# Altium schematic sheet CPU_wireless_shield.SchDoc
size A3
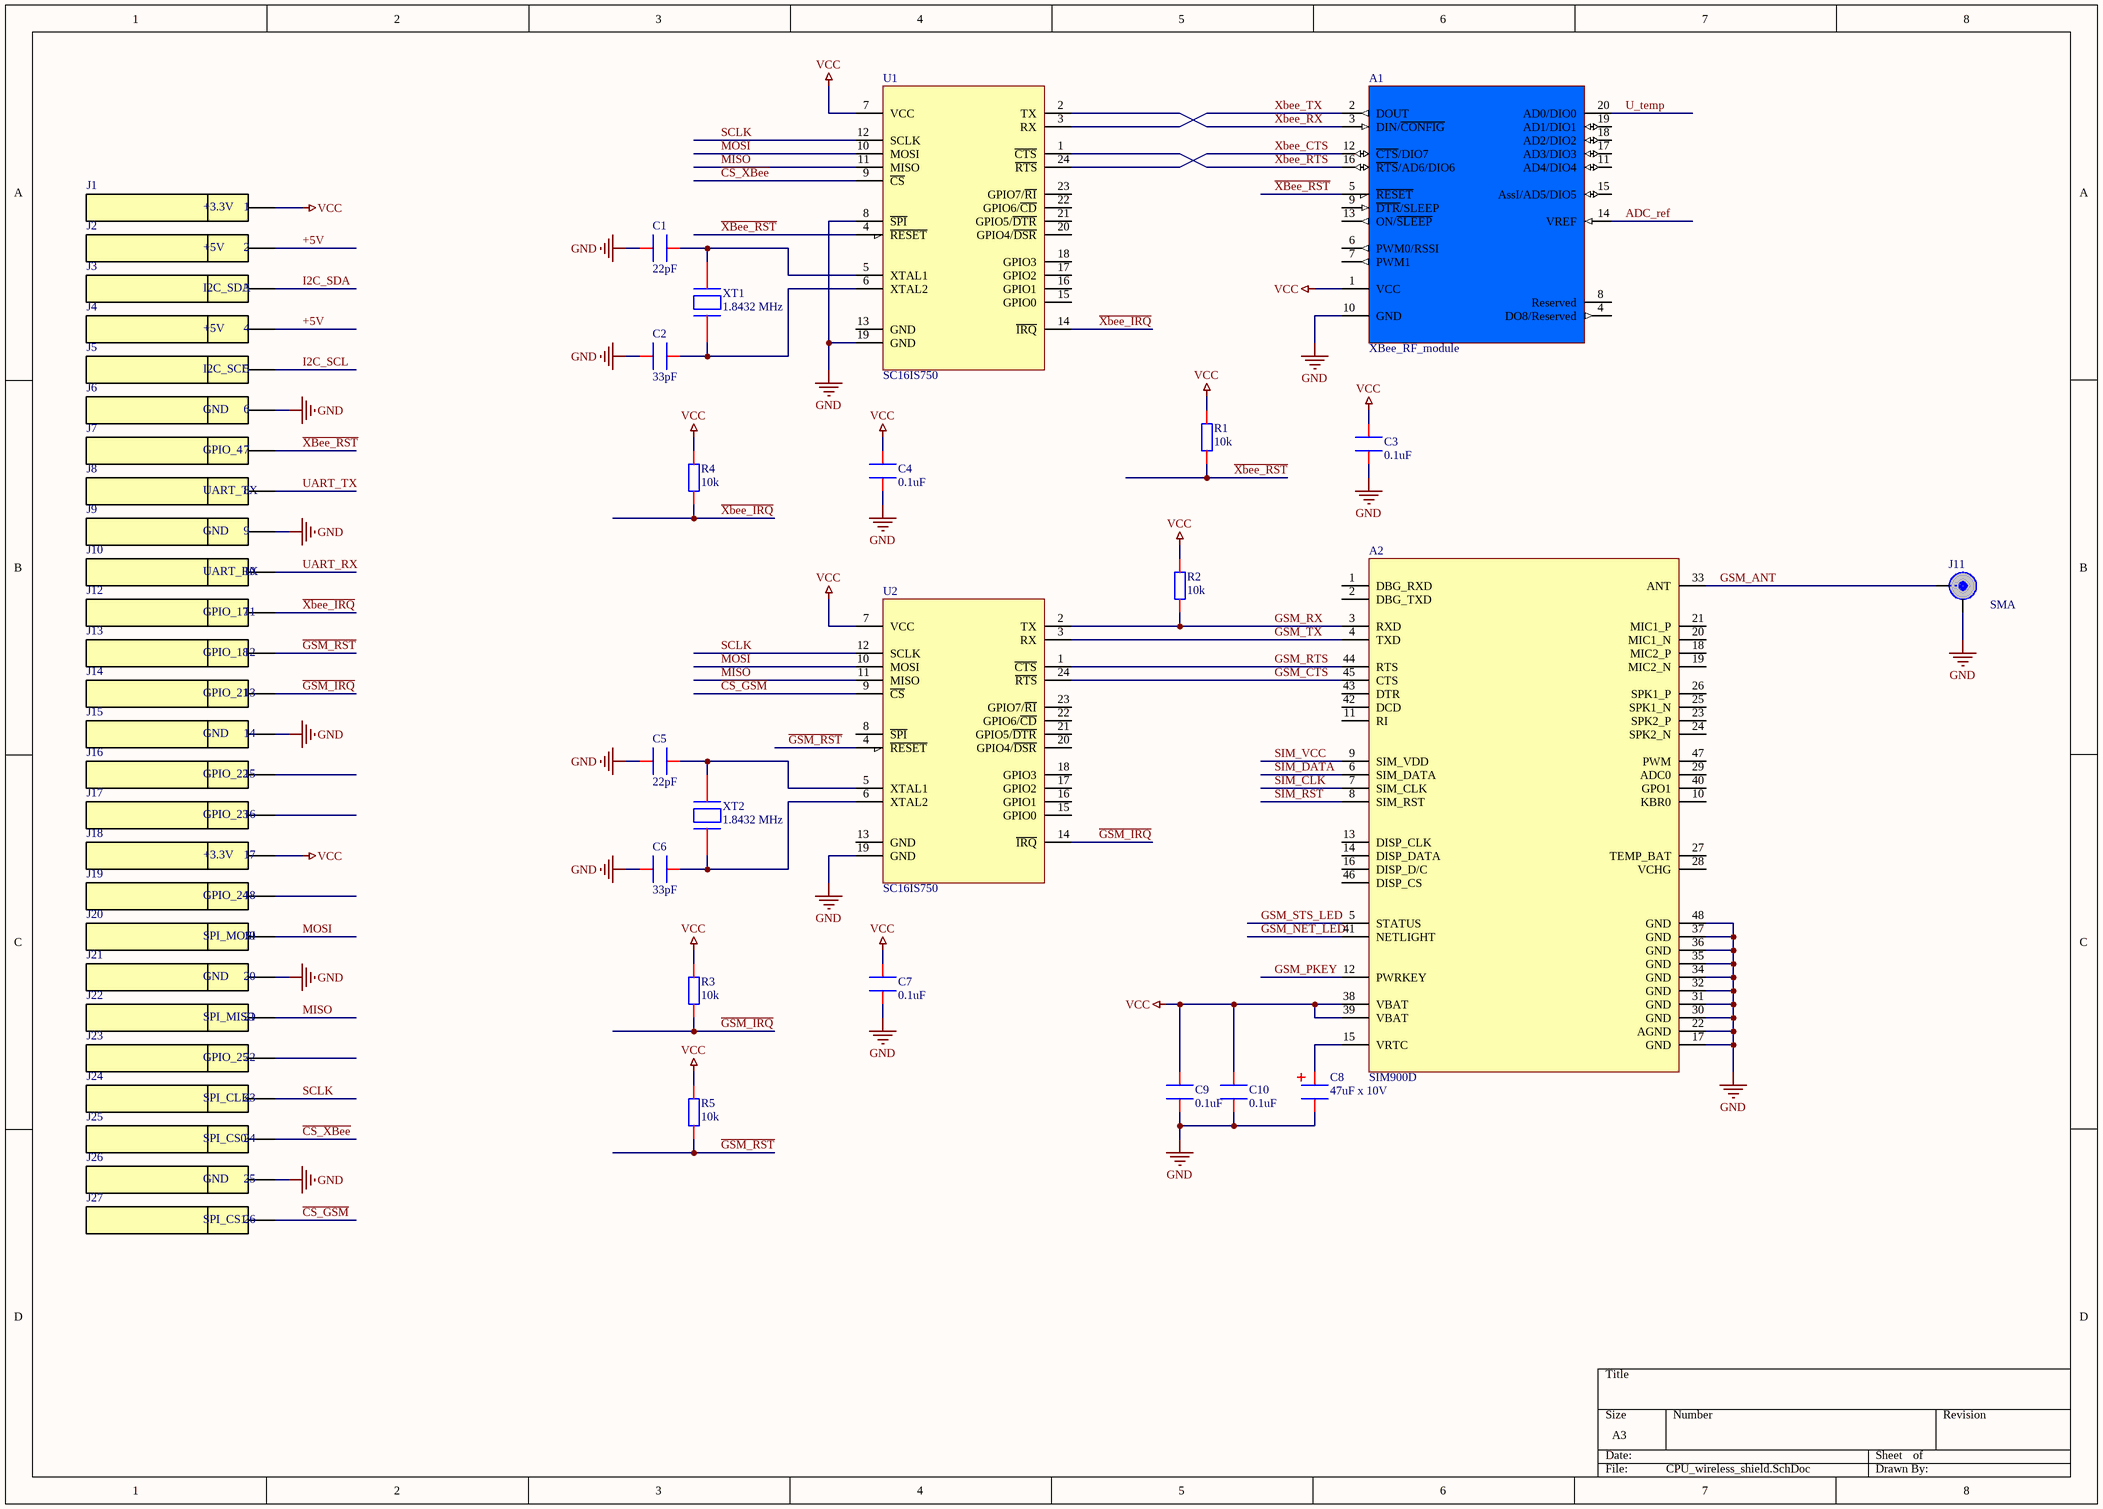
[diagram p0: CPU_wireless_shield.SchDoc]

## Parts
A1  XBee_RF_module  [XBee_module]
A2  SIM900D  [SIM900D]
C1  22pF  [C0805]
C2  33pF  [C0805]
C3  0.1uF  [C0805]
C4  0.1uF  [C0805]
C5  22pF  [C0805]
C6  33pF  [C0805]
C7  0.1uF  [C0805]
C8  47uF x 10V  [SM_C_TANT_B]
C9  0.1uF  [C0805]
C10  0.1uF  [C0805]
J1  Pin_V2  [SOCKET]  (value not drawn)
J2  Pin_V2  [SOCKET]  (value not drawn)
J3  Pin_V2  [SOCKET]  (value not drawn)
J4  Pin_V2  [SOCKET]  (value not drawn)
J5  Pin_V2  [SOCKET]  (value not drawn)
J6  Pin_V2  [SOCKET]  (value not drawn)
J7  Pin_V2  [SOCKET]  (value not drawn)
J8  Pin_V2  [SOCKET]  (value not drawn)
J9  Pin_V2  [SOCKET]  (value not drawn)
J10  Pin_V2  [SOCKET]  (value not drawn)
J11  SMA  [SMA-J]
J12  Pin_V2  [SOCKET]  (value not drawn)
J13  Pin_V2  [SOCKET]  (value not drawn)
J14  Pin_V2  [SOCKET]  (value not drawn)
J15  Pin_V2  [SOCKET]  (value not drawn)
J16  Pin_V2  [SOCKET]  (value not drawn)
J17  Pin_V2  [SOCKET]  (value not drawn)
J18  Pin_V2  [SOCKET]  (value not drawn)
J19  Pin_V2  [SOCKET]  (value not drawn)
J20  Pin_V2  [SOCKET]  (value not drawn)
J21  Pin_V2  [SOCKET]  (value not drawn)
J22  Pin_V2  [SOCKET]  (value not drawn)
J23  Pin_V2  [SOCKET]  (value not drawn)
J24  Pin_V2  [SOCKET]  (value not drawn)
J25  Pin_V2  [SOCKET]  (value not drawn)
J26  Pin_V2  [SOCKET]  (value not drawn)
J27  Pin_V2  [SOCKET]  (value not drawn)
R1  10k  [R0805]
R2  10k  [R0805]
R3  10k  [R0805]
R4  10k  [R0805]
R5  10k  [R0805]
U1  SC16IS750  [TSSOP-24]
U2  SC16IS750  [TSSOP-24]
XT1  1.8432 MHz  [HC-49U/S]
XT2  1.8432 MHz  [HC-49U/S]

## Nets
GND: A1.10(GND) A2.17(GND) A2.22(AGND) A2.30(GND) A2.31(GND) A2.32(GND) A2.34(GND) A2.35(GND) A2.36(GND) A2.37(GND) A2.48(GND) C1.1 C2.1 C3.2 C4.2 C5.1 C6.1 C7.2 C8.2 C9.2 C10.2 J6.1 J9.1 J11.SH J15.1 J21.1 J26.1 U1.8(~{SPI}) U1.19(GND) U2.19(GND)
VCC: A1.1(VCC) A2.38(VBAT) A2.39(VBAT) C3.1 C4.1 C7.1 C9.1 C10.1 J1.1 J18.1 R1.2 R2.2 R3.2 R4.2 R5.2 U1.7(VCC) U2.7(VCC)
+5V: J2.1 J4.1
ADC_ref: A1.14(VREF)
~{CS_GSM}: J27.1 U2.9(~{CS})
~{CS_XBee}: J25.1 U1.9(~{CS})
~{GSM_IRQ}: J14.1 R3.1 U2.14(~{IRQ})
~{GSM_RST}: J13.1 R5.1 U2.4(~{RESET})
GSM_ANT: A2.33(ANT) J11.I
GSM_CTS: A2.45(CTS) U2.24(~{RTS})
GSM_NET_LED: A2.41(NETLIGHT)
GSM_PKEY: A2.12(PWRKEY)
GSM_RTS: A2.44(RTS) U2.1(~{CTS})
GSM_RX: A2.3(RXD) R2.1 U2.2(TX)
GSM_STS_LED: A2.5(STATUS)
GSM_TX: A2.4(TXD) U2.3(RX)
I2C_SCL: J5.1
I2C_SDA: J3.1
MISO: J22.1 U1.11(MISO) U2.11(MISO)
MOSI: J20.1 U1.10(MOSI) U2.10(MOSI)
SCLK: J24.1 U1.12(SCLK) U2.12(SCLK)
SIM_CLK: A2.7(SIM_CLK)
SIM_DATA: A2.6(SIM_DATA)
SIM_RST: A2.8(SIM_RST)
SIM_VCC: A2.9(SIM_VDD)
U_temp: A1.20(AD0/DIO0)
UART_RX: J10.1
UART_TX: J8.1
~{Xbee_IRQ}: J12.1 R4.1 U1.14(~{IRQ})
~{XBee_RST}: A1.5(~{RESET}) J7.1 R1.1 U1.4(~{RESET})
Xbee_CTS: A1.12(~{CTS}/DIO7) U1.24(~{RTS})
Xbee_RTS: A1.16(~{RTS}/AD6/DIO6) U1.1(~{CTS})
Xbee_RX: A1.3(DIN/~{CONFIG}) U1.2(TX)
Xbee_TX: A1.2(DOUT) U1.3(RX)
NetA2_15: A2.15(VRTC) C8.1
NetC1_2: C1.2 U1.5(XTAL1) XT1.2
NetC2_2: C2.2 U1.6(XTAL2) XT1.1
NetC5_2: C5.2 U2.5(XTAL1) XT2.2
NetC6_2: C6.2 U2.6(XTAL2) XT2.1

Not connected (* = marked no-connect by the designer): A1 4(DO8/Reserved) 6(PWM0/RSSI) 7(PWM1) 8(Reserved) 9(~{DTR}/SLEEP) 11(AD4/DIO4) 13(ON/~{SLEEP}) 15(AssI/AD5/DIO5) 17(AD3/DIO3) 18(AD2/DIO2) 19(AD1/DIO1); A2 1(DBG_RXD) 2(DBG_TXD) 10(KBR0) 11(RI) 13(DISP_CLK) 14(DISP_DATA) 16(DISP_D/C) 18(MIC2_P) 19(MIC2_N) 20(MIC1_N) 21(MIC1_P) 23(SPK2_P) 24(SPK2_N) 25(SPK1_N) 26(SPK1_P) 27(TEMP_BAT) 28(VCHG) 29(ADC0) 40(GPO1) 42(DCD) 43(DTR) 46(DISP_CS) 47(PWM); J16 1; J17 1; J19 1; J23 1; U1 13(GND) 15(GPIO0) 16(GPIO1) 17(GPIO2) 18(GPIO3) 20(GPIO4/~{DSR}) 21(GPIO5/~{DTR}) 22(GPIO6/~{CD}) 23(GPIO7/~{RI}); U2 8(~{SPI}) 13(GND) 15(GPIO0) 16(GPIO1) 17(GPIO2) 18(GPIO3) 20(GPIO4/~{DSR}) 21(GPIO5/~{DTR}) 22(GPIO6/~{CD}) 23(GPIO7/~{RI})

## Library data of the parts
C1-C7 C9 C10 = C0805
  C1 C5: value: 22pF
  C2 C6: value: 33pF
  C3 C4 C7 C9 C10: value: 0.1uF
C8 = CAP_pol: value: 47uF x 10V
J1 = Pin_1: Name1: +3.3V; Num: 1
J2 = Pin_1: Name1: +5V; Num: 2
J3 = Pin_1: Name1: I2C_SDA; Num: 3
J4 = Pin_1: Name1: +5V; Num: 4
J5 = Pin_1: Name1: I2C_SCL; Num: 5
J6 = Pin_1: Name1: GND; Num: 6
J7 = Pin_1: Name1: GPIO_4; Num: 7
J8 = Pin_1: Name1: UART_TX; Num: 8
J9 = Pin_1: Name1: GND; Num: 9
J10 = Pin_1: Name1: UART_RX; Num: 10
J11 = SMA-J
J12 = Pin_1: Name1: GPIO_17; Num: 11
J13 = Pin_1: Name1: GPIO_18; Num: 12
J14 = Pin_1: Name1: GPIO_21; Num: 13
J15 = Pin_1: Name1: GND; Num: 14
J16 = Pin_1: Name1: GPIO_22; Num: 15
J17 = Pin_1: Name1: GPIO_23; Num: 16
J18 = Pin_1: Name1: +3.3V; Num: 17
J19 = Pin_1: Name1: GPIO_24; Num: 18
J20 = Pin_1: Name1: SPI_MOSI; Num: 19
J21 = Pin_1: Name1: GND; Num: 20
J22 = Pin_1: Name1: SPI_MISO; Num: 21
J23 = Pin_1: Name1: GPIO_25; Num: 22
J24 = Pin_1: Name1: SPI_CLK; Num: 23
J25 = Pin_1: Name1: SPI_CS0; Num: 24
J26 = Pin_1: Name1: GND; Num: 25
J27 = Pin_1: Name1: SPI_CS1; Num: 26
R1-R5 = RES_SMD: value: 10k
XT1 XT2 = XTAL: Value: 1.8432 MHz